# Altium schematic sheet I2C_Header.SchDoc: Title
size A4; Date: *******; ApprovedBy: *******; CheckedBy: None; Author: *******; CompanyName: *******; DrawnBy: Name; Engineer: *******; Organization: *******; Address1: *******; Address2: *******; Address3: *******; Address4: *******; DocumentNumber: 8; Revision: *******; SheetNumber: 8; SheetTotal: 11; CurrentTime: *******; CurrentDate: *******; Time: *******; DocumentFullPathAndName: *******; DocumentName: *******; ModifiedDate: *******; ImagePath: *******; ProjectName: *******; Application_BuildNumber: *******
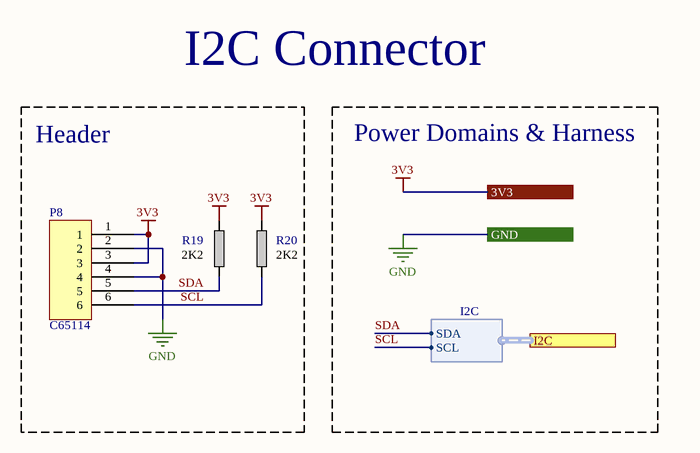
[diagram p0: I2C_Header.SchDoc]

## Parts
P8  Manufacturer Part Number: C65114  [HEADER 3X2]  (hidden comment: HEADER 6POS)
R19  value 2K2  [0805]  (hidden comment: RES)
R20  value 2K2  [0805]  (hidden comment: RES)

## Blocks framed on the sheet
Header: P8 R19 R20

## Ports
3V3 (see Lens-Maker[3B], A4988[3B], ESP32_Block[3C], ESP32_Module[3B], GPIO_Header[3B], Power[3B], SPI_Header[3B], Stepper_Driver[3A]), GND (see Lens-Maker[3B], A4988[3B], ESP32_Block[3D], ESP32_Module[3B], GPIO_Header[3B], Mechanical_Holes[3B], Power[3C], SPI_Header[3B], Stepper_Driver[3B], USB_Connector[3B]), I2C (harness I2C, see Lens-Maker[3B], ESP32_Module[2B])

## Harnesses
I2C: SDA, SCL

## Nets
3V3: P8.1 P8.3 R19.1 R20.1 ; port 3V3
GND: P8.2 P8.4 ; port GND
SCL: P8.6 R20.2 ; port I2C.SCL
SDA: P8.5 R19.2 ; port I2C.SDA

## Notes on the sheet
- I2C Connector
- Power Domains & Harness
- Title:
- Size:
- Date:
- Drawn By:
- Page Contents:
- A4
- Checked By:
- Revision:
- Sheet
- of

## Library data of the parts
P8 = HEADER 6POS: Straight 2 6 2.54mm Black Straight,P=2.54mm  Pin Headers ROHS; Manufacturer: BOOMELE(Boom Precision Elec); Supplier: JLCPCB; Supplier Part Number: C65114
R19 R20 = RES: 125mW Thick Film Resistors ±5% 2.2kΩ 0805  Chip Resistor - Surface Mount ROHS; Manufacturer: LIZ Elec; Manufacturer Part Number: CR0805J80222G; Supplier: JLCPCB; Supplier Part Number: C101970